# Altium schematic sheet MCU.SchDoc
size B
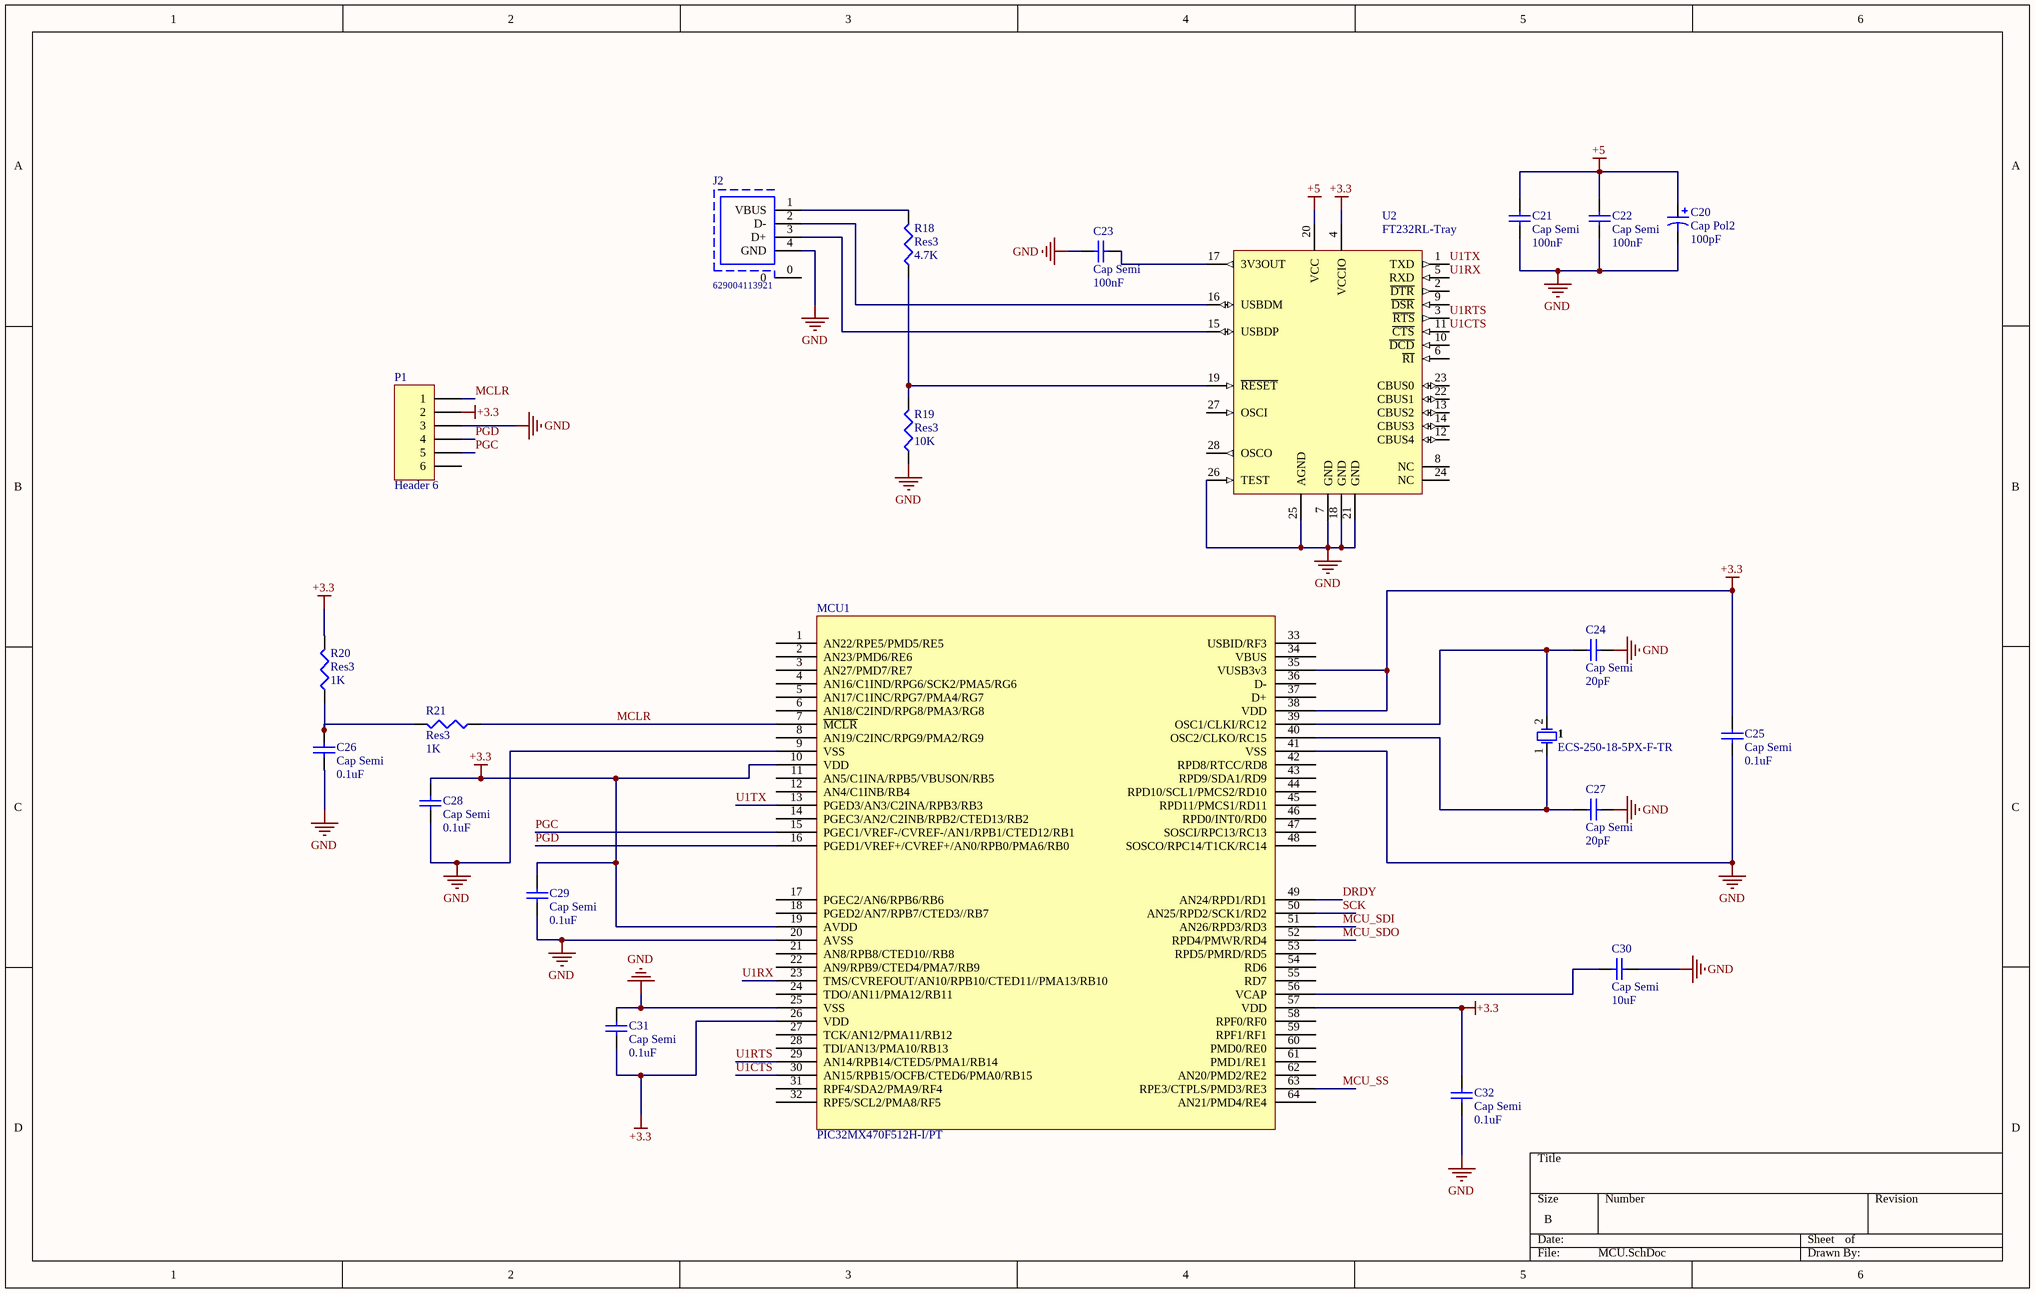
[diagram p0: MCU.SchDoc]

## Parts
1  ECS-250-18-5PX-F-TR  [XTAL/S]
C20  Cap Pol2  value 100pF  [φ6.5-1]
C21  Cap Semi  value 100nF  [0805c]
C22  Cap Semi  value 100nF  [0805c]
C23  Cap Semi  value 100nF  [0805c]
C24  Cap Semi  value 20pF  [0805c]
C25  Cap Semi  value 0.1uF  [0805c]
C26  Cap Semi  value 0.1uF  [0805c]
C27  Cap Semi  value 20pF  [0805c]
C28  Cap Semi  value 0.1uF  [0805c]
C29  Cap Semi  value 0.1uF  [0805c]
C30  Cap Semi  value 10uF  [0805c]
C31  Cap Semi  value 0.1uF  [0805c]
C32  Cap Semi  value 0.1uF  [0805c]
J2  629004113921  [USB-公头]
MCU1  PIC32MX470F512H-I/PT  [*QFP50P1200X1200X120-64N]
P1  Header 6  [HDR1X6]
R18  Res3  value 4.7K  [0805]
R19  Res3  value 10K  [0805]
R20  Res3  value 1K  [0805]
R21  Res3  value 1K  [0805]
U2  FT232RL-Tray  [SSOP-28]

## Nets
+3.3: C25.2 C28.2 C29.2 C31.1 C32.2 MCU1.10(VDD) MCU1.19(AVDD) MCU1.26(VDD) MCU1.35(VUSB3v3) MCU1.38(VDD) MCU1.57(VDD) P1.2 R20.2 U2.4(VCCIO)
+5: C20.1 C21.2 C22.2 U2.20(VCC)
GND: C20.2 C21.1 C22.1 C23.2 C24.2 C25.1 C26.1 C27.2 C28.1 C29.1 C30.2 C31.2 C32.1 J2.4(GND) MCU1.9(VSS) MCU1.20(AVSS) MCU1.25(VSS) MCU1.41(VSS) P1.3 R19.1 U2.7(GND) U2.18(GND) U2.21(GND) U2.25(AGND) U2.26(TEST)
DRDY: MCU1.49(AN24/RPD1/RD1)
MCLR: MCU1.7(~{MCLR}) P1.1 R21.1
MCU_SDI: MCU1.51(AN26/RPD3/RD3)
MCU_SDO: MCU1.52(RPD4/PMWR/RD4)
MCU_SS: MCU1.63(RPE3/CTPLS/PMD3/RE3)
PGC: MCU1.15(PGEC1/VREF-/CVREF-/AN1/RPB1/CTED12/RB1) P1.5
PGD: MCU1.16(PGED1/VREF+/CVREF+/AN0/RPB0/PMA6/RB0) P1.4
SCK: MCU1.50(AN25/RPD2/SCK1/RD2)
U1CTS: MCU1.30(AN15/RPB15/OCFB/CTED6/PMA0/RB15) U2.11(~{CTS})
U1RTS: MCU1.29(AN14/RPB14/CTED5/PMA1/RB14) U2.3(~{RTS})
U1RX: MCU1.23(TMS/CVREFOUT/AN10/RPB10/CTED11//PMA13/RB10) U2.5(RXD)
U1TX: MCU1.13(PGED3/AN3/C2INA/RPB3/RB3) U2.1(TXD)
Net1_1: 1.1 C27.1 MCU1.40(OSC2/CLKO/RC15)
Net1_2: 1.2 C24.1 MCU1.39(OSC1/CLKI/RC12)
NetC23_1: C23.1 U2.17(3V3OUT)
NetC26_2: C26.2 R20.1 R21.2
NetC30_1: C30.1 MCU1.56(VCAP)
NetJ2_1: J2.1(VBUS) R18.2
NetJ2_2: J2.2(D-) U2.16(USBDM)
NetJ2_3: J2.3(D+) U2.15(USBDP)
NetR18_1: R18.1 R19.2 U2.19(~{RESET})

Not connected (* = marked no-connect by the designer): J2 0; MCU1 1(AN22/RPE5/PMD5/RE5) 2(AN23/PMD6/RE6) 3(AN27/PMD7/RE7) 4(AN16/C1IND/RPG6/SCK2/PMA5/RG6) 5(AN17/C1INC/RPG7/PMA4/RG7) 6(AN18/C2IND/RPG8/PMA3/RG8) 8(AN19/C2INC/RPG9/PMA2/RG9) 11(AN5/C1INA/RPB5/VBUSON/RB5) 12(AN4/C1INB/RB4) 14(PGEC3/AN2/C2INB/RPB2/CTED13/RB2) 17(PGEC2/AN6/RPB6/RB6) 18(PGED2/AN7/RPB7/CTED3//RB7) 21(AN8/RPB8/CTED10//RB8) 22(AN9/RPB9/CTED4/PMA7/RB9) 24(TDO/AN11/PMA12/RB11) 27(TCK/AN12/PMA11/RB12) 28(TDI/AN13/PMA10/RB13) 31(RPF4/SDA2/PMA9/RF4) 32(RPF5/SCL2/PMA8/RF5) 33(USBID/RF3) 34(VBUS) 36(D-) 37(D+) 42(RPD8/RTCC/RD8) 43(RPD9/SDA1/RD9) 44(RPD10/SCL1/PMCS2/RD10) 45(RPD11/PMCS1/RD11) 46(RPD0/INT0/RD0) 47(SOSCI/RPC13/RC13) 48(SOSCO/RPC14/T1CK/RC14) 53(RPD5/PMRD/RD5) 54(RD6) 55(RD7) 58(RPF0/RF0) 59(RPF1/RF1) 60(PMD0/RE0) 61(PMD1/RE1) 62(AN20/PMD2/RE2) 64(AN21/PMD4/RE4); P1 6; U2 2(~{DTR}) 6(~{RI}) 8(NC) 9(~{DSR}) 10(~{DCD}) 12(CBUS4) 13(CBUS2) 14(CBUS3) 22(CBUS1) 23(CBUS0) 24(NC) 27(OSCI) 28(OSCO)

## Library data of the parts
1 = CMP-2000-05725-1: Low Profile Crystal, 14.7456 MHz, 18 pF, -20 to 70 degC, 2-Pin SMD, RoHS, Tape and Reel; Manufacturer: ABRACON; ESR: 50Ohms; Case Width: 4.7mm; Case Length: 11.4mm; Frequency Stability: 50PPM; Tolerance: 20PPM; Case Height: 4.2mm; Load Capacitance: 18pF; Datasheet URL: http://www.abracon.com/Resonators/abls.pdf; Package / Case: HC-49/US; Dimensions: 4.7mmWx11.4mmLx4.2mmH; Mounting Technology: SurfaceMount; RoHS: Details; Series: ABLS; Frequency: 14.7456MHz; Datasheet Version: 04/2011; Mounting Style: SMD/SMT; Packaging: Reel; Factory Pack Quantity: 1000; Product Category: Crystals; Package Reference: ABLS-14.7456MHZ-B2-T; Package URL: http://www.abracon.com/Support/PackageDrawing/Resonators/ABLS-2D.pdf; Manufacturer URL: http://www.abracon.com/; Package Description: 2-Pin Surface Mount Device, Body 11.4 x 4.7 mm; Termination Style: SMD/SMT; Operating Temperature Range: -20Cto+70C; Type: LowProfileMicroprocessorCrystal; Brand: ABRACON
C20 = Cap Pol2: Polarized Capacitor (Axial); Published: 8-Jun-2000; PackageReference: POLAR0.8; Publisher: Altium Limited; PackageDescription: Polarized Capacitor; 2 Leads; LatestRevisionDate: 17-Jul-2002; LatestRevisionNote: Re-released for DXP Platform.
C21-C32 = Cap Semi: Capacitor (Semiconductor SIM Model); Published: 8-Jun-2000; LatestRevisionDate: 29-May-2009; LatestRevisionNote: IPC-7351 Footprint Added.; PackageReference: C1206; Publisher: Altium Limited; PackageDescription: Chip Capacitor
J2 = CMP-1502-03242-1: USB 2.0 Type A Plug WR-COM, Horizontal, SMT, with Clips; Manufacturer: Wurth Elektronik; Contact Resistance: 20mOhm; Working Voltage: 30VAC; Rated Current: 1.5A; Packaging: Tube; Operating Temperature: -40to105degC; Manufacturer URL: http://www.we-online.de; Orientation: Horizontal; Datasheet URL: https://katalog.we-online.de/em/datasheet/629004113921.pdf; Package Reference: 629004113921; Mounting Technology: SMT; Gender: Plug; Publisher: WurthElektronik; Part Number: 629004113921; Connector Type: USB2.0TypeA
P1 = Header 6: Header, 6-Pin; LatestRevisionDate: 17-Jul-2002; LatestRevisionNote: Re-released for DXP Platform.; Publisher: Altium Limited
R18-R21 = Res3: Resistor; Published: 8-Jun-2000; LatestRevisionDate: 29-May-2009; LatestRevisionNote: IPC-7351 Footprint Added.; PackageReference: J1-0603; Publisher: Altium Limited; PackageDescription: Chip Resistor
U2 = COM-UART-FT232R-IL28: USB UART Asynchronous Serial Data Transfer Chip, SSOP-28, Tray; DatasheetVersion: ver 2.07, Jul-2010; PackageVersion: 2010; PackageReference: SSOP-28; PackageDescription: 28-Pin Small Outline Package 0.65 mm Pitch